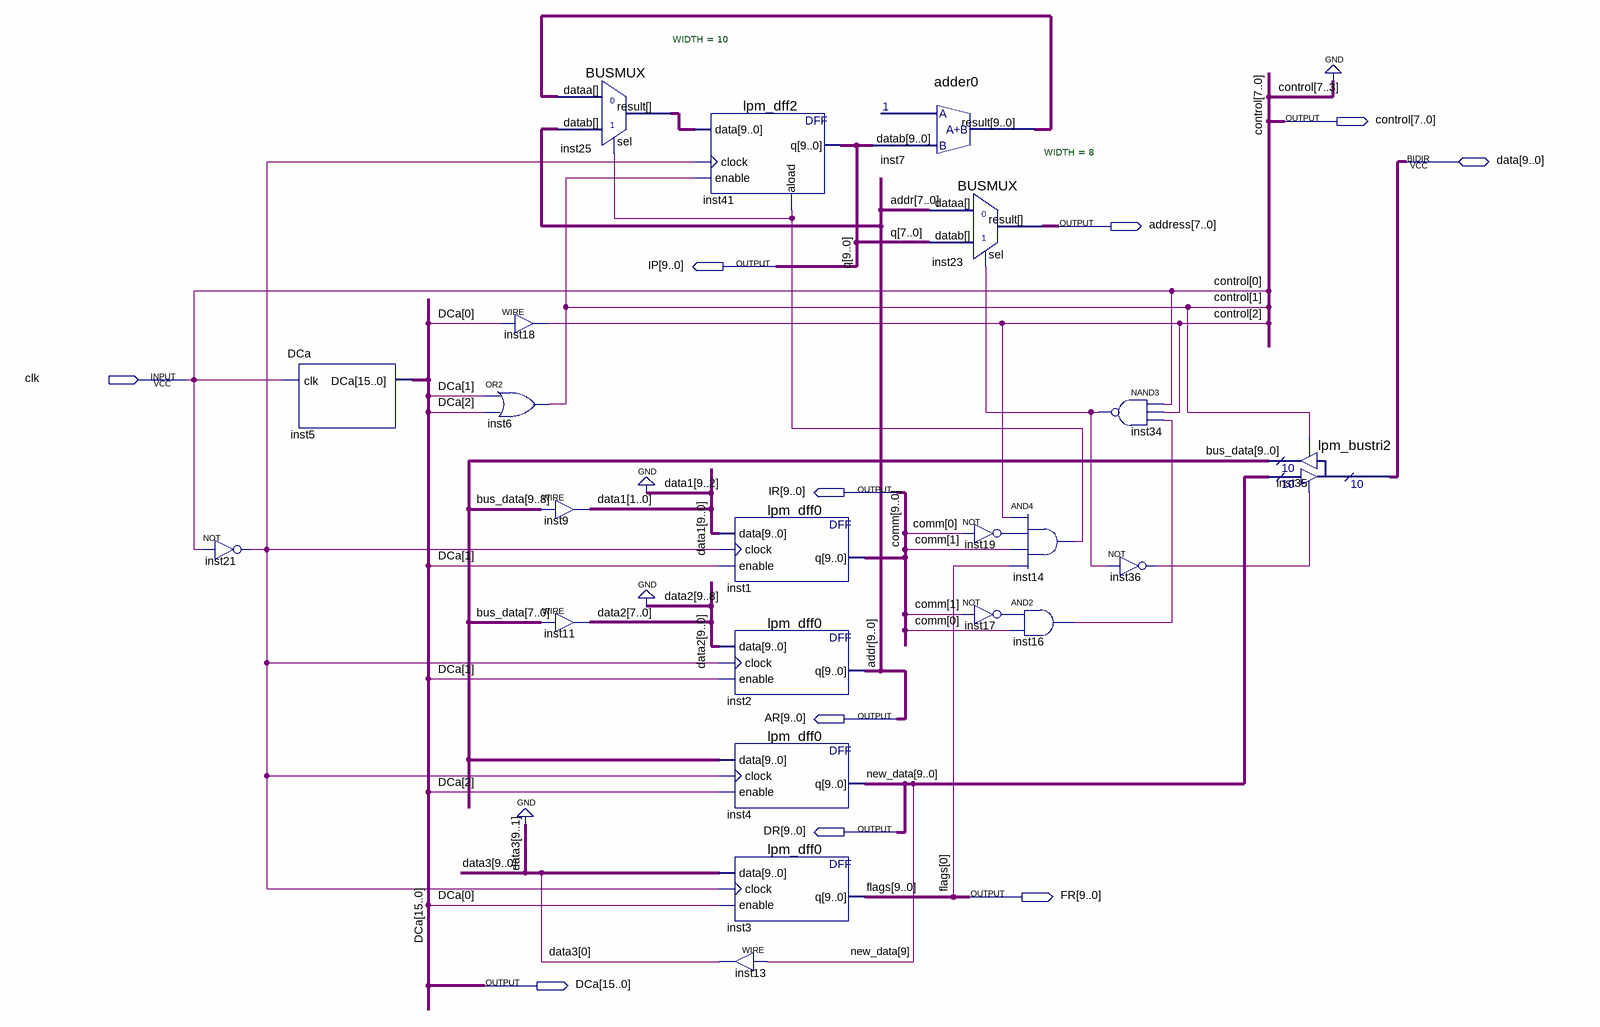
[diagram p0: schematic sheet]
// Quartus schematic cu.bdf as structural Verilog: 22 symbols, 10 pins
module cu (
  input  clk,
  inout  [9:0] data,
  output [7:0] control,
  output [7:0] address,
  output [9:0] IP,
  output [9:0] IR,
  output [9:0] AR,
  output [9:0] DR,
  output [9:0] FR,
  output [15:0] DCa
);

  wire inst14_out, inst16_out, inst17_out, inst19_out, inst21_out, inst34_out, inst36_out;
  wire [0:0] data3;
  wire [1:0] data1;
  wire [7:0] data2;
  wire [9:0] bus_data, inst7_result, inst25_result;

  not inst21 (inst21_out, clk);
  DCa inst5 (.clk(clk), .DCa(DCa));
  assign control[2] = DCa[0];  // WIRE inst18
  or inst6 (control[1], DCa[1], DCa[2]);
  BUSMUX #(.WIDTH(10)) inst25 (.datab(AR), .sel(inst14_out), .dataa(inst7_result), .result(inst25_result));
  assign data1 = bus_data[9:8];  // WIRE inst9
  assign data2 = bus_data[7:0];  // WIRE inst11
  lpm_dff2 inst41 (.data(inst25_result), .clock(inst21_out), .enable(control[1]), .aload(inst14_out), .q(IP));
  lpm_dff0 inst1 (.data({{8{1'b0}}, data1}), .clock(inst21_out), .enable(DCa[1]), .q(IR));
  lpm_dff0 inst2 (.data({2'b00, data2}), .clock(inst21_out), .enable(DCa[1]), .q(AR));
  lpm_dff0 inst4 (.data(bus_data), .clock(inst21_out), .enable(DCa[2]), .q(DR));
  lpm_dff0 inst3 (.data({{9{1'b0}}, data3[0]}), .clock(inst21_out), .enable(DCa[0]), .q(FR));
  assign data3[0] = DR[9];  // WIRE inst13
  adder0 inst7 (.datab(IP), .result(inst7_result));
  BUSMUX #(.WIDTH(8)) inst23 (.datab(IP[7:0]), .sel(inst34_out), .dataa(AR[7:0]), .result(address));
  not inst19 (inst19_out, IR[0]);
  not inst17 (inst17_out, IR[1]);
  and inst14 (inst14_out, control[2], inst19_out, IR[1], FR[0]);
  and inst16 (inst16_out, inst17_out, IR[0]);
  nand inst34 (inst34_out, clk, control[2], inst16_out);
  not inst36 (inst36_out, inst34_out);
  lpm_bustri2 inst35 (.enabledt(inst36_out), .data(DR), .enabletr(control[1]), .result(bus_data), .tridata(data));

  assign {control[7:3], control[0]} = {{5{1'b0}}, clk};

  // Other names for the same wires on the sheet: addr[9:0] = AR; flags[9:0] = FR; q[9:0] = IP; comm[9:0] = IR;
  //   new_data[9:0] = DR
endmodule
